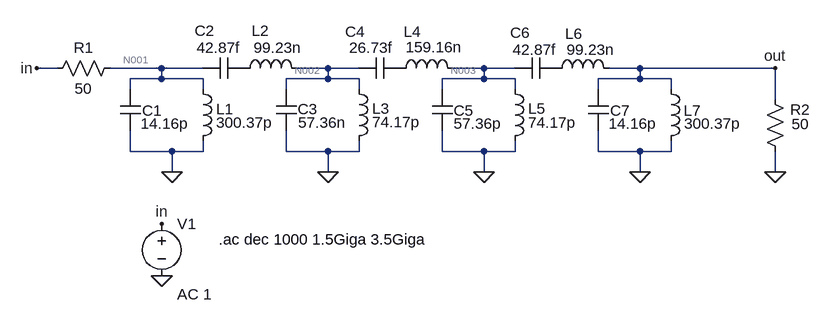
[diagram p0: schematic bandpass_scaled_picture.asc]
bandpass_scaled_picture.asc, the LTspice schematic file:
Version 4
SHEET 1 880 680
WIRE -320 112 -352 112
WIRE -160 112 -240 112
WIRE -96 112 -160 112
WIRE 96 112 48 112
WIRE 144 112 96 112
WIRE 336 112 288 112
WIRE 384 112 336 112
WIRE 576 112 528 112
WIRE 784 112 576 112
WIRE -160 128 -160 112
WIRE -160 128 -208 128
WIRE -96 128 -160 128
WIRE 96 128 96 112
WIRE 96 128 32 128
WIRE 144 128 96 128
WIRE 336 128 336 112
WIRE 336 128 272 128
WIRE 384 128 336 128
WIRE 576 128 576 112
WIRE 576 128 512 128
WIRE 624 128 576 128
WIRE -208 144 -208 128
WIRE -96 144 -96 128
WIRE 32 144 32 128
WIRE 144 144 144 128
WIRE 272 144 272 128
WIRE 384 144 384 128
WIRE 512 144 512 128
WIRE 624 144 624 128
WIRE 784 160 784 112
WIRE -208 240 -208 208
WIRE -144 240 -208 240
WIRE -96 240 -96 224
WIRE -96 240 -144 240
WIRE 32 240 32 208
WIRE 96 240 32 240
WIRE 144 240 144 224
WIRE 144 240 96 240
WIRE 272 240 272 208
WIRE 336 240 272 240
WIRE 384 240 384 224
WIRE 384 240 336 240
WIRE 512 240 512 208
WIRE 576 240 512 240
WIRE 624 240 624 224
WIRE 624 240 576 240
WIRE -144 272 -144 240
WIRE 96 272 96 240
WIRE 336 272 336 240
WIRE 576 272 576 240
WIRE 784 272 784 240
FLAG 784 272 0
FLAG -144 272 0
FLAG 96 272 0
FLAG 336 272 0
FLAG 576 272 0
FLAG -352 112 in
FLAG 784 112 out
FLAG -160 432 0
FLAG -160 352 in
SYMBOL res -224 96 R90
WINDOW 0 0 56 VBottom 2
WINDOW 3 32 56 VTop 2
SYMATTR InstName R1
SYMATTR Value 50
SYMBOL res 800 256 R180
WINDOW 0 -38 80 Left 2
WINDOW 3 -36 58 Left 2
SYMATTR InstName R2
SYMATTR Value 50
SYMBOL ind -48 128 R270
WINDOW 0 58 40 VTop 2
WINDOW 3 63 67 VBottom 2
SYMATTR InstName L2
SYMATTR Value 99.23n
SYMBOL ind 192 128 R270
WINDOW 0 57 34 VTop 2
WINDOW 3 64 67 VBottom 2
SYMATTR InstName L4
SYMATTR Value 159.16n
SYMBOL ind 432 128 R270
WINDOW 0 54 42 VTop 2
WINDOW 3 60 68 VBottom 2
SYMATTR InstName L6
SYMATTR Value 99.23n
SYMBOL cap 16 144 R0
WINDOW 0 33 31 Left 2
WINDOW 3 34 52 Left 2
SYMATTR InstName C3
SYMATTR Value 57.36n
SYMBOL cap -224 144 R0
WINDOW 0 34 33 Left 2
WINDOW 3 32 53 Left 2
SYMATTR InstName C1
SYMATTR Value 14.16p
SYMBOL ind -112 128 R0
WINDOW 0 36 47 Left 2
WINDOW 3 36 68 Left 2
SYMATTR InstName L1
SYMATTR Value 300.37p
SYMBOL cap -32 96 R90
WINDOW 0 -26 62 VBottom 2
WINDOW 3 -31 40 VTop 2
SYMATTR InstName C2
SYMATTR Value 42.87f
SYMBOL ind 128 128 R0
WINDOW 0 36 46 Left 2
WINDOW 3 36 67 Left 2
SYMATTR InstName L3
SYMATTR Value 74.17p
SYMBOL cap 208 96 R90
WINDOW 0 -25 70 VBottom 2
WINDOW 3 -31 46 VTop 2
SYMATTR InstName C4
SYMATTR Value 26.73f
SYMBOL cap 256 144 R0
WINDOW 0 33 33 Left 2
WINDOW 3 33 53 Left 2
SYMATTR InstName C5
SYMATTR Value 57.36p
SYMBOL ind 368 128 R0
WINDOW 0 36 46 Left 2
WINDOW 3 36 68 Left 2
SYMATTR InstName L5
SYMATTR Value 74.17p
SYMBOL cap 448 96 R90
WINDOW 0 -23 56 VBottom 2
WINDOW 3 -28 34 VTop 2
SYMATTR InstName C6
SYMATTR Value 42.87f
SYMBOL cap 496 144 R0
WINDOW 0 34 33 Left 2
WINDOW 3 32 53 Left 2
SYMATTR InstName C7
SYMATTR Value 14.16p
SYMBOL ind 608 128 R0
WINDOW 0 35 49 Left 2
WINDOW 3 36 69 Left 2
SYMATTR InstName L7
SYMATTR Value 300.37p
SYMBOL voltage -160 336 R0
WINDOW 123 24 124 Left 2
WINDOW 39 0 0 Left 0
SYMATTR InstName V1
SYMATTR Value ""
SYMATTR Value2 AC 1
TEXT -72 376 Left 2 !.ac dec 1000 1.5Giga 3.5Giga

The netlist it stands for:
* bandpass_scaled_picture.asc
R1 N001 in 50
R2 0 out 50
L2 P001 N002 99.23n
L4 P002 N003 159.16n
L6 P003 out 99.23n
C3 N002 0 57.36n
C1 N001 0 14.16p
L1 N001 0 300.37p
C2 P001 N001 42.87f
L3 N002 0 74.17p
C4 P002 N002 26.73f
C5 N003 0 57.36p
L5 N003 0 74.17p
C6 P003 N003 42.87f
C7 out 0 14.16p
L7 out 0 300.37p
V1 in 0 AC 1
.ac dec 1000 1.5Giga 3.5Giga
.backanno
.end

* Results of the author's LTspice run, read from the files saved beside the schematic
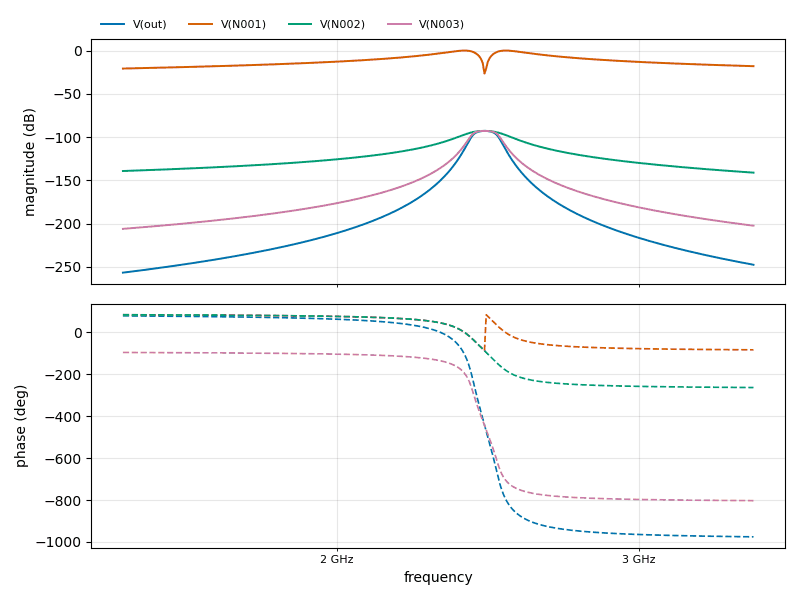
[diagram p1: AC Analysis of bandpass_scaled_picture.asc, plotted from the saved traces]
* AC Analysis, 1 run:
*   V(out): -256.64 dB at 1.5 GHz, -247.51 dB at 3.5 GHz, peak -92.85 dB at 2.438 GHz, 3 dB below the peak at 2.407 GHz and 2.473 GHz
*   V(N001): -20.83 dB at 1.5 GHz, -18.08 dB at 3.5 GHz, peak -0.02 dB at 2.507 GHz, 3 dB below the peak at 2.472 GHz and 2.589 GHz
*   V(N002): -139.21 dB at 1.5 GHz, -141.09 dB at 3.5 GHz, peak -92.85 dB at 2.438 GHz, 3 dB below the peak at 2.384 GHz and 2.494 GHz
*   V(N003): -206.04 dB at 1.5 GHz, -202.41 dB at 3.5 GHz, peak -92.85 dB at 2.438 GHz, 3 dB below the peak at 2.402 GHz and 2.478 GHz